# EAGLE design qo-100-rf-switch (EAGLE 9.6.2)
CNAME: None; CREVISION: 2; DESIGNER: Joao Silva
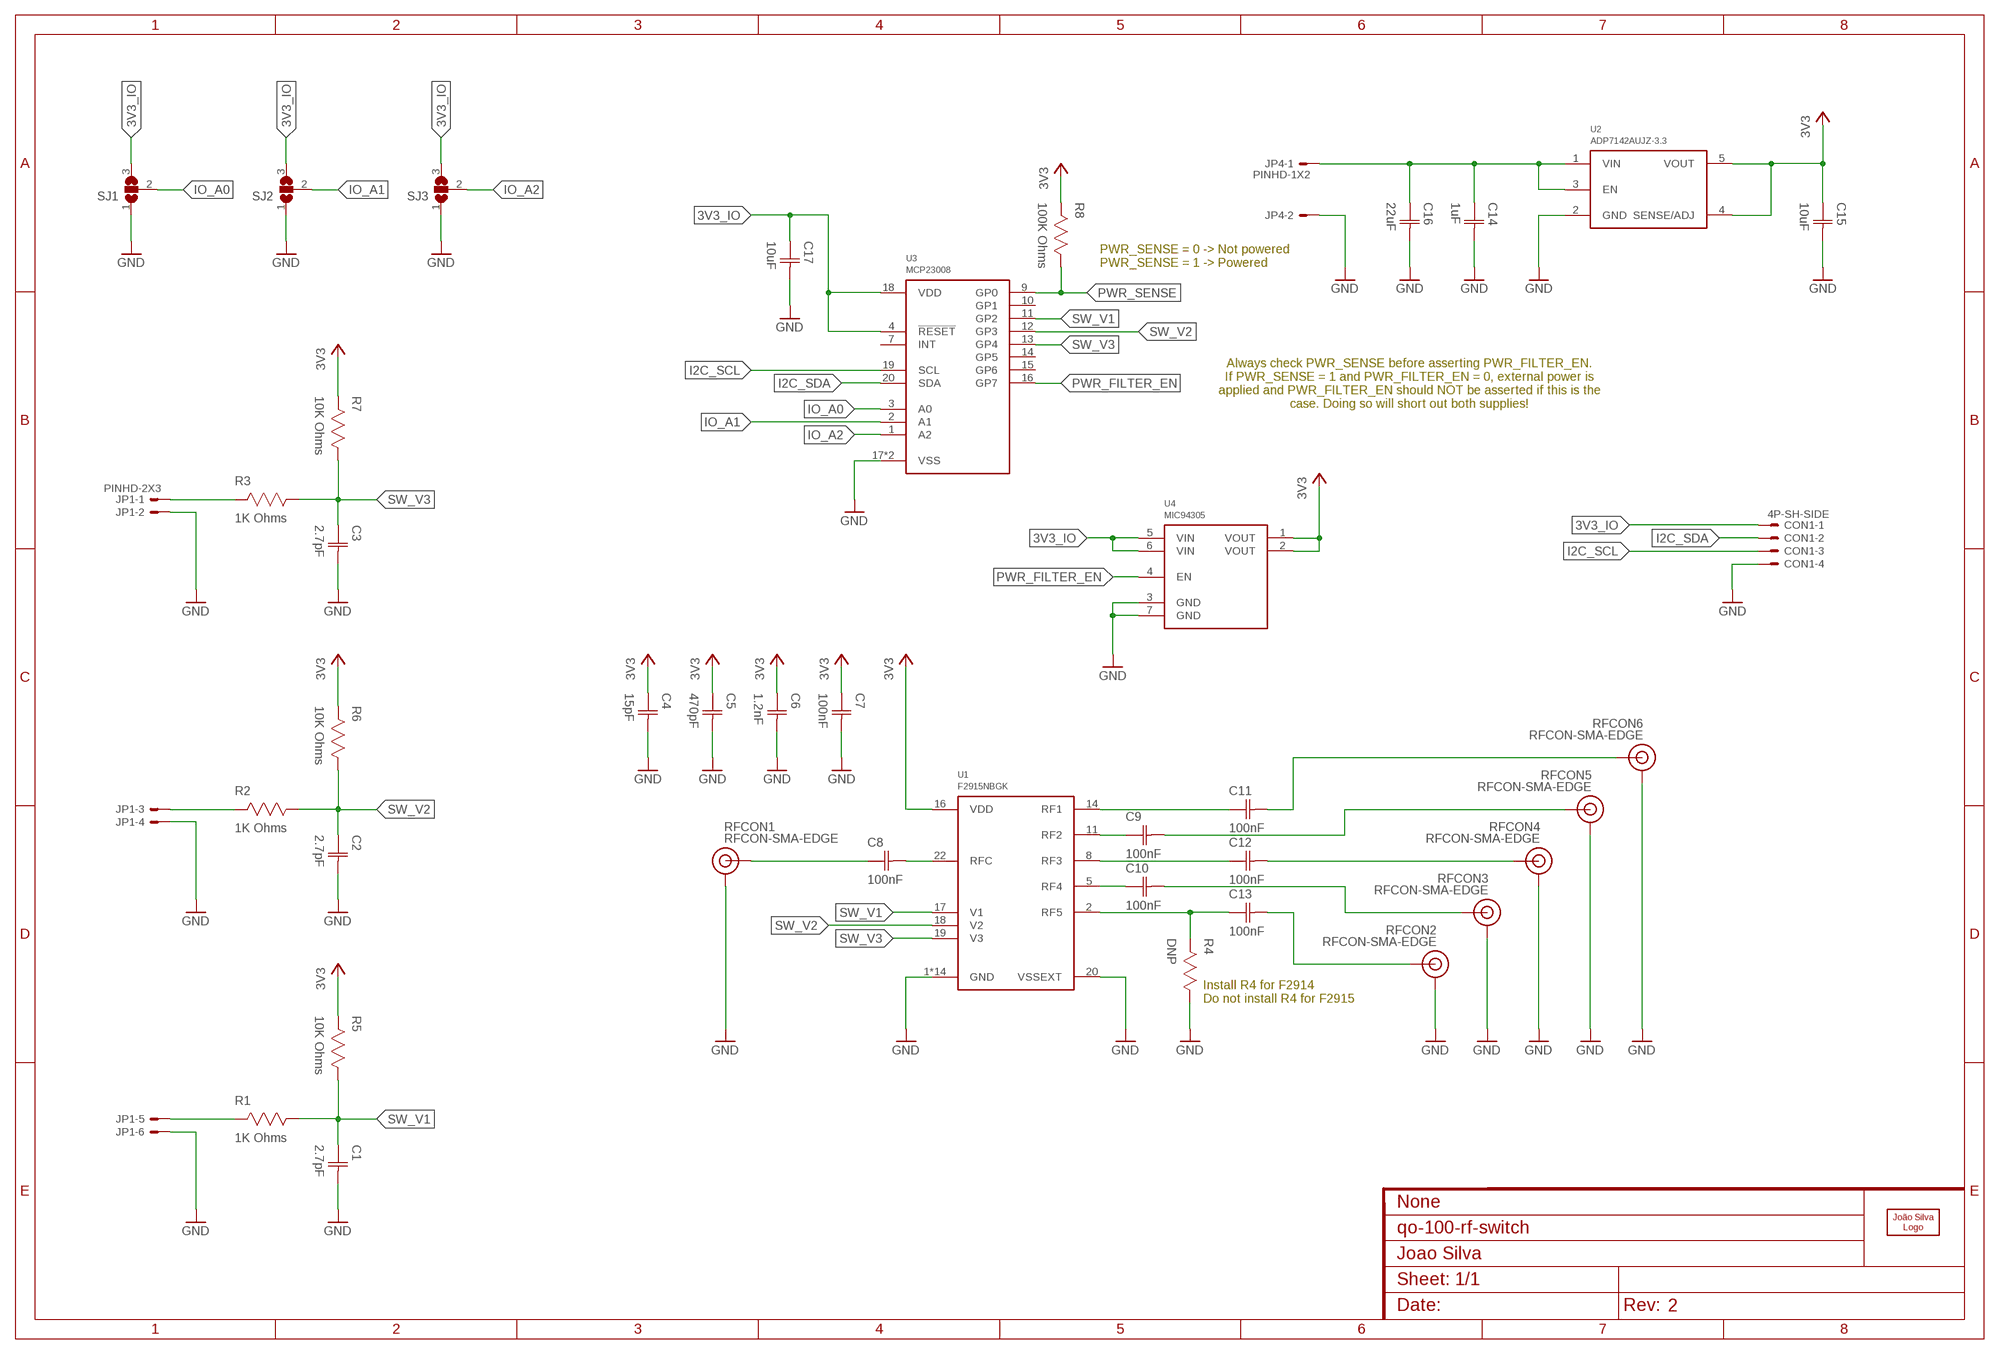
[diagram p0: schematic, sheet 1]

## Parts
C1  2.7pF  CAPACITOR-0603  [CAP0603]
C2  2.7pF  CAPACITOR-0603  [CAP0603]
C3  2.7pF  CAPACITOR-0603  [CAP0603]
C4  15pF  CAPACITOR-0603  [CAP0603]
C5  470pF  CAPACITOR-0603  [CAP0603]
C6  1.2nF  CAPACITOR-0603  [CAP0603]
C7  100nF  CAPACITOR-0603  [CAP0603]
C8  100nF  CAPACITOR-0603  [CAP0603]
C9  100nF  CAPACITOR-0603  [CAP0603]
C10  100nF  CAPACITOR-0603  [CAP0603]
C11  100nF  CAPACITOR-0603  [CAP0603]
C12  100nF  CAPACITOR-0603  [CAP0603]
C13  100nF  CAPACITOR-0603  [CAP0603]
C14  1uF  CAPACITOR-0603  [CAP0603]
C15  10uF  CAPACITOR-0603  [CAP0603]
C16  22uF  CAPACITOR-1206  [CAP1206]
C17  10uF  CAPACITOR-0603  [CAP0603]
CON1  4P-SH-SIDE  [SH-04-SIDE]
JP1  PINHD-2X3  [2X03]
JP4  PINHD-1X2  [1X02]
LOGO1  JS-5MM  [JS_5MM]
R1  1K Ohms  RESISTOR-0603  [RES0603]
R2  1K Ohms  RESISTOR-0603  [RES0603]
R3  1K Ohms  RESISTOR-0603  [RES0603]
R4  DNP  RESISTOR-0603  [RES0603]
R5  10K Ohms  RESISTOR-0603  [RES0603]
R6  10K Ohms  RESISTOR-0603  [RES0603]
R7  10K Ohms  RESISTOR-0603  [RES0603]
R8  100K Ohms  RESISTOR-0603  [RES0603]
RFCON1  RFCON-SMA-EDGE  [SMA-EDGE]
RFCON2  RFCON-SMA-EDGE  [SMA-EDGE]
RFCON3  RFCON-SMA-EDGE  [SMA-EDGE]
RFCON4  RFCON-SMA-EDGE  [SMA-EDGE]
RFCON5  RFCON-SMA-EDGE  [SMA-EDGE]
RFCON6  RFCON-SMA-EDGE  [SMA-EDGE]
SJ1  SJ2S  [SJ2_S]
SJ2  SJ2S  [SJ2_S]
SJ3  SJ2S  [SJ2_S]
U1  F2915NBGK  [QFN24]
U2  ADP7142AUJZ-3.3  [SOT23-5]
U3  MCP23008  [QFN20]
U4  MIC94305  [DFN6]

## Nets
3V3: C4.1(C1) C5.1(C1) C6.1(C1) C7.1(C1) C15.1(C1) R5.2 R6.2 R7.2 R8.2 U1.16(VDD) U2.4(SENSE/ADJ) U2.5(VOUT) U4.1(VOUT) U4.2(VOUT)
3V3_IO: C17.1(C1) CON1.1 SJ1.3 SJ2.3 SJ3.3 U3.4(!RESET) U3.18(VDD) U4.5(VIN) U4.6(VIN)
GND: C1.2(C2) C2.2(C2) C3.2(C2) C4.2(C2) C5.2(C2) C6.2(C2) C7.2(C2) C14.2(C2) C15.2(C2) C16.2(C2) C17.2(C2) CON1.4 JP1.2 JP1.4 JP1.6 JP4.2 R4.1 RFCON1.GND@0(GND) RFCON1.GND@1(GND) RFCON1.GND@2(GND) RFCON1.GND@3(GND) RFCON2.GND@0(GND) RFCON2.GND@1(GND) RFCON2.GND@2(GND) RFCON2.GND@3(GND) RFCON3.GND@0(GND) RFCON3.GND@1(GND) RFCON3.GND@2(GND) RFCON3.GND@3(GND) RFCON4.GND@0(GND) RFCON4.GND@1(GND) RFCON4.GND@2(GND) RFCON4.GND@3(GND) RFCON5.GND@0(GND) RFCON5.GND@1(GND) RFCON5.GND@2(GND) RFCON5.GND@3(GND) RFCON6.GND@0(GND) RFCON6.GND@1(GND) RFCON6.GND@2(GND) RFCON6.GND@3(GND) SJ1.1 SJ2.1 SJ3.1 U1.1(GND) U1.3(GND) U1.4(GND) U1.6(GND) U1.7(GND) U1.9(GND) U1.10(GND) U1.12(GND) U1.13(GND) U1.15(GND) U1.20(VSSEXT) U1.21(GND) U1.23(GND) U1.24(GND) U1.25(GND) U2.2(GND) U3.17(VSS) U3.PAD(VSS) U4.3(GND) U4.7(GND)
I2C_SCL: CON1.3 U3.19(SCL)
I2C_SDA: CON1.2 U3.20(SDA)
IO_A0: SJ1.2 U3.3(A0)
IO_A1: SJ2.2 U3.2(A1)
IO_A2: SJ3.2 U3.1(A2)
N$1: C8.1(C1) RFCON1.SIG(SIGNAL)
N$2: C8.2(C2) U1.22(RFC)
N$3: C13.1(C1) R4.2 U1.2(RF5)
N$4: C10.1(C1) U1.5(RF4)
N$5: C12.1(C1) U1.8(RF3)
N$6: C9.1(C1) U1.11(RF2)
N$7: C11.1(C1) U1.14(RF1)
N$8: C13.2(C2) RFCON2.SIG(SIGNAL)
N$9: C10.2(C2) RFCON3.SIG(SIGNAL)
N$10: C12.2(C2) RFCON4.SIG(SIGNAL)
N$11: C9.2(C2) RFCON5.SIG(SIGNAL)
N$12: C11.2(C2) RFCON6.SIG(SIGNAL)
N$13: JP1.1 R3.2
N$14: JP1.3 R2.2
N$15: JP1.5 R1.2
N$16: C14.1(C1) C16.1(C1) JP4.1 U2.1(VIN) U2.3(EN)
PWR_FILTER_EN: U3.16(GP7) U4.4(EN)
PWR_SENSE: R8.1 U3.9(GP0)
SW_V1: C1.1(C1) R1.1 R5.1 U1.17(V1) U3.11(GP2)
SW_V2: C2.1(C1) R2.1 R6.1 U1.18(V2) U3.12(GP3)
SW_V3: C3.1(C1) R3.1 R7.1 U1.19(V3) U3.13(GP4)
Unconnected: U3.7(INT) U3.10(GP1) U3.14(GP5) U3.15(GP6)

## Notes on the sheet
- PWR_SENSE = 0 -> Not powered
  PWR_SENSE = 1 -> Powered
- Always check PWR_SENSE before asserting PWR_FILTER_EN.
  If PWR_SENSE = 1 and PWR_FILTER_EN = 0, external power is
  applied and PWR_FILTER_EN should NOT be asserted if this is the
  case. Doing so will short out both supplies!
- Install R4 for F2914
  Do not install R4 for F2915

## Library data of the parts
C1-C17 = Capacitor:CAPACITOR
CON1 = JST:4P: Disconnectable Crimp style connector, 1.0mm pitch 4 contacts
JP1 = Pin Header:PINHD-2X3: PIN HEADER
JP4 = Pin Header:PINHD-1X2: PIN HEADER
LOGO1 = Silkscreen:JS
R1-R8 = Resistor:RESISTOR
RFCON1-RFCON6 = RF Connector:RFCON
SJ1-SJ3 = Solder Jumper:SJ2
U1 = Renesas:F2915*
U2 = Analog Devices:ADP7142AUJZ*
U3 = Microchip:MCP23008
U4 = Microchip:MIC94305

## Board
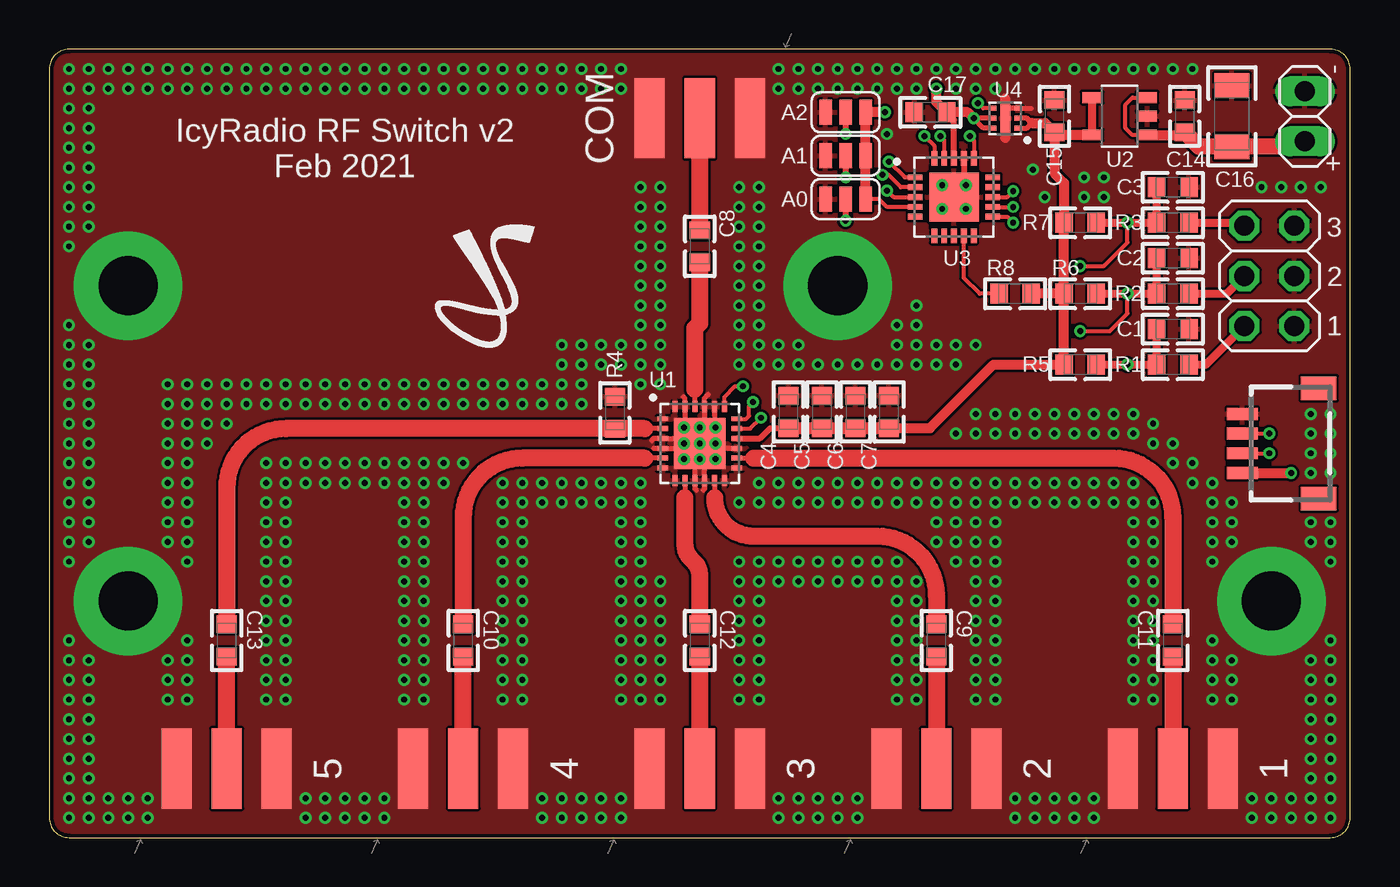
[diagram p1: board, top side]
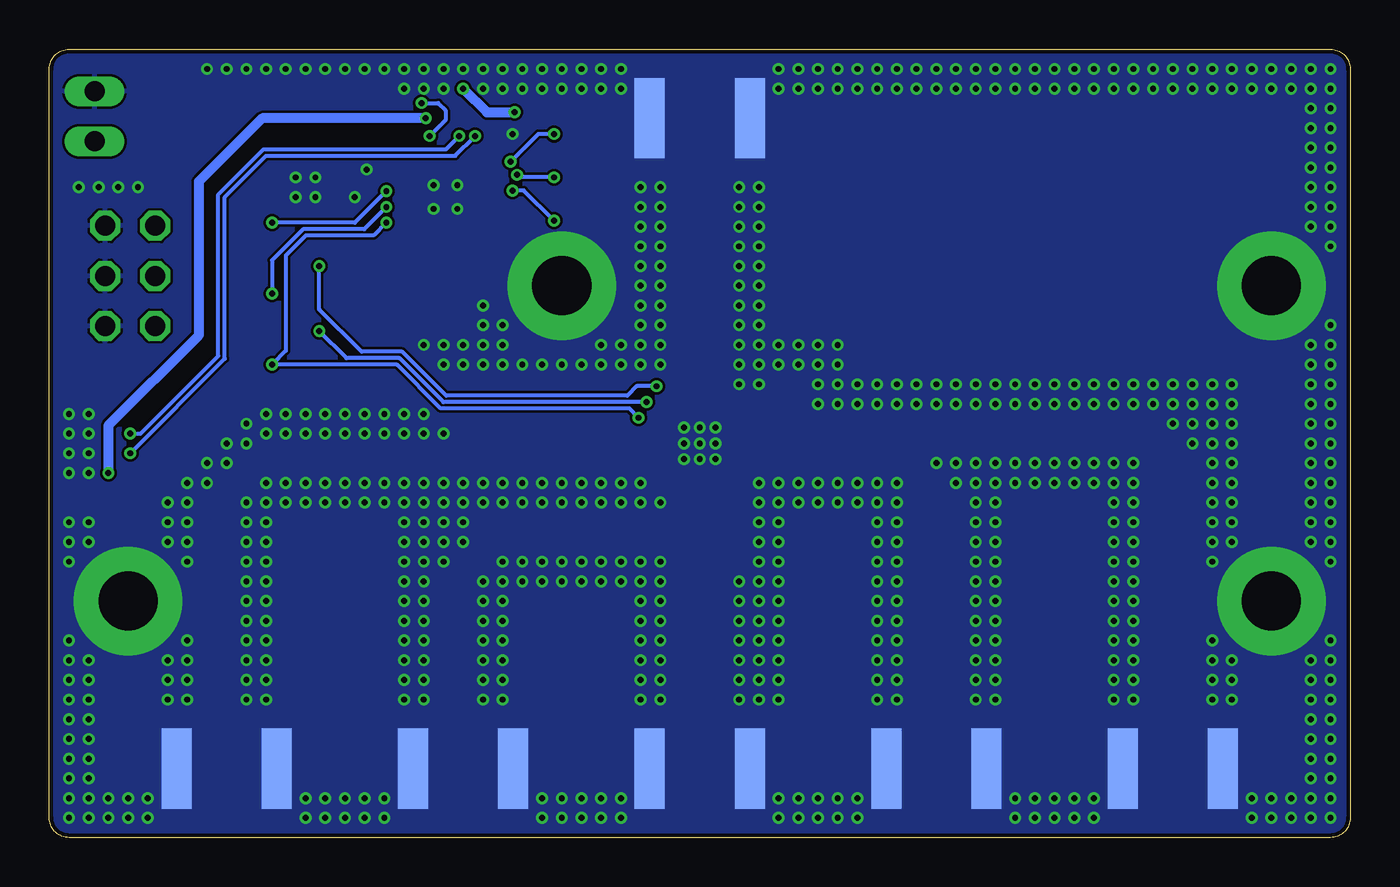
[diagram p2: board, bottom side, seen from below]

Size 66 x 40 mm. Coordinates in mm from the lower left corner, seen from the top.
Outline: 0,39 0,1 arc90 1,0 65,0 arc90 66,1 66,39 arc90 65,40 1,40 arc90 0,39
Copper layers (1*16): Top 0.035mm / dielectric 1.6mm / Bottom 0.035mm
Design rules "jlcpcb_2layer": minimum track width 5mil, minimum drill 0.3mm, track to track 5mil, track to pad 5mil, pad to pad 5mil, via to via 5mil, smd to smd 5mil, copper to edge 0.2mm, drill to drill 5mil, minimum pad ring 3mil, minimum via ring 3mil, stop-mask expansion 0.075mm, vias tented up to drill 10mm, thermal gap 5mil

### Footprints (pad centres in the part's own frame; a part is rotated, then mirrored left to right if it is on the bottom)
CAP0603 = smd 0.889 x 1.016: 1 -0.819,0; 2 0.819,0
CAP1206 = smd 1.27 x 1.778: 1 -1.549,0; 2 1.549,0
SH-04-SIDE = smd 0.6 x 1.55: 1 -1.5,2.975; 2 -0.5,2.975; 3 0.5,2.975; 4 1.5,2.975 | smd 1.2 x 1.8: FIT@1 -2.8,-0.9; FIT@2 2.8,-0.9
2X03 = drill 1.016 octagon: 1 -2.54,-1.27; 2 -2.54,1.27; 3 0,-1.27; 4 0,1.27; 5 2.54,-1.27; 6 2.54,1.27
1X02 = drill 1.016 long: 1 -1.27,0; 2 1.27,0
RES0603 = smd 0.889 x 1.016: 1 -0.819,0; 2 0.819,0
SMA-EDGE = smd 1.524 x 4.064: GND@0 -2.54,0; GND@1 2.54,0; SIG 0,0 | smd 1.524 x 4.064 bottom: GND@2 -2.54,0; GND@3 2.54,0
SJ2_S = smd 0.635 x 1.27: 1 -1.016,0; 2 0,0; 3 1.016,0
QFN24 = smd 0.55 x 0.25: 1 -1.875,1.25; 2 -1.875,0.75; 3 -1.875,0.25; 4 -1.875,-0.25; 5 -1.875,-0.75; 6 -1.875,-1.25; 13 1.875,-1.25; 14 1.875,-0.75; 15 1.875,-0.25; 16 1.875,0.25; 17 1.875,0.75; 18 1.875,1.25 | smd 0.25 x 0.55: 7 -1.25,-1.875; 8 -0.75,-1.875; 9 -0.25,-1.875; 10 0.25,-1.875; 11 0.75,-1.875; 12 1.25,-1.875; 19 1.25,1.875; 20 0.75,1.875; 21 0.25,1.875; 22 -0.25,1.875; 23 -0.75,1.875; 24 -1.25,1.875 | smd 2.6 x 2.6: 25 0,0
SOT23-5 = smd 1 x 0.55: 1 -1.4,0.95; 2 -1.4,0; 3 -1.4,-0.95; 4 1.4,-0.95; 5 1.4,0.95
QFN20 = smd 0.73 x 0.3: 1 -1.965,1; 2 -1.965,0.5; 3 -1.965,0; 4 -1.965,-0.5; 5 -1.965,-1; 11 1.965,-1; 12 1.965,-0.5; 13 1.965,0; 14 1.965,0.5; 15 1.965,1 | smd 0.3 x 0.73: 6 -1,-1.965; 7 -0.5,-1.965; 8 0,-1.965; 9 0.5,-1.965; 10 1,-1.965; 16 1,1.965; 17 0.5,1.965; 18 0,1.965; 19 -0.5,1.965; 20 -1,1.965 | smd 2.5 x 2.5: PAD 0,0
DFN6 = smd 0.25 x 0.4: 1 -0.5,-0.65; 2 0,-0.65; 3 0.5,-0.65; 4 0.5,0.65; 5 0,0.65; 6 -0.5,0.65 | smd 1.4 x 0.5: 7 0,0

### Placement (x,y rotation side)
C1  57,25.8 0 top
C2  57,29.4 0 top
C3  57,33 0 top
C4  37.5,21.6 90 top
C5  39.2,21.6 90 top
C6  40.9,21.6 90 top
C7  42.6,21.6 90 top
C8  33,30 270 top
C9  45,10 270 top
C10  21,10 270 top
C11  57,10 270 top
C12  33,10 270 top
C13  9,10 270 top
C14  57.6,36.6 90 top
C15  51,36.6 90 top
C16  60,36.6 90 top
C17  44.7,36.8 180 top
CON1  63.5,20 90 top
JP1  61.9,28.5 270 top
JP4  63.7,36.6 90 top
LOGO1  24.8,31.3 0 top
R1  57,24 0 top
R2  57,27.6 0 top
R3  57,31.2 0 top
R4  28.7,21.55 270 top
R5  52.3,24 180 top
R6  52.3,27.6 180 top
R7  52.3,31.2 180 top
R8  49,27.6 0 top
RFCON1  33,36.5 180 top
RFCON2  9,3.5 0 top
RFCON3  21,3.5 0 top
RFCON4  33,3.5 0 top
RFCON5  45,3.5 0 top
RFCON6  57,3.5 0 top
SJ1  40.4,32.4 0 top
SJ2  40.4,34.6 0 top
SJ3  40.4,36.8 0 top
U1  33,20 0 top
U2  54.3,36.6 180 top
U3  45.9,32.5 0 top
U4  48.5,36.5 90 top

### Tracks (layer width: path | path; a pad name or v marks a point on that pad's centre or on a via)
3V3
  Top 0.254: U4.1 49.6,36 49.85,36.25 49.6,36.5 U4.2
  Top 0.305: U1.16 36.05,20.25 36.58,20.78 C4.1
  Top 0.406: U2.4 U2.5
  Top 0.508: U2.5 51.13,35.65 C15.1 | C15.1 51,33.7 51.48,33.22 R7.2 R6.2 | R6.2 R5.2 47.9,24 44.68,20.78 C7.1 | 49.85,36.25 50.53,36.25 C15.1 | R6.2 R8.2
  Top 0.61: C4.1 C5.1 C6.1 C7.1
3V3_IO  (via drill 0.3)
  Top 0.2: U3.4 42.5,32 42.1,32.4 SJ1.3
  Top 0.254: U4.5 v46.9,36.5 47.4,36 U4.6
  Top 0.305: U3.18 45.9,36.42 C17.1
  Top 0.508: v42.4,36.8 SJ3.3 SJ2.3 SJ1.3 | 46.9,36.52 v46.9,36.5 46.6,36.8 C17.1 45,37.32 v45,38 | CON1.1 v63,18.5
  Bottom 0.508: v63,18.5 63,20.9 58.4,25.5 58.4,33.3 55.2,36.5 v46.9,36.5 | v45,38 43.8,36.8 v42.4,36.8
GND  (via drill 0.3, 3 pad 5.5)
  Top 0.254: 30.55,20.14 30.66,20.25 U1.3 31.95,20.25 v32.2,20 31.95,19.75 U1.4 30.66,19.75 | 33.17,17.63 33.25,17.71 U1.10 33.25,18.95 v33,19.2 32.75,18.95 U1.9 32.75,17.71 32.83,17.63 | U1.15 34.05,19.75 v33.8,20 | 32.17,22.37 32.25,22.29 U1.23 32.25,20.85 v32.2,20.8 | 33.43,22.5 33.43,22.47 33.25,22.29 U1.21 33.25,21.05 v33,20.8 | U1.20 33.75,20.85 v33.8,20.8 | 48.5,36.9 48.6,37 U4.3 49.8,37
  Top 0.305: U3.17 46.4,33 U3.PAD
  Top 0.406: U3.PAD v45.3,31.9
  Top 0.508: 48.5,37.5 48.5,36.9 U4.7 48.5,35.5
  other vias: 4,12 4,28 62,12 40,28 33,20 32.2,19.2 33.8,19.2 27,23 26,23 25,23 25,22 27,22 26,22 24,23 23,23 22,23 22,22 24,22 23,22 6,7 7,7 8,21 9,21 11,16 11,18 11,17 12,17 11,19 6,9 6,8 7,8 7,10 7,9 6,19 6,18 6,17 7,17 7,19 7,18 6,16 6,15 8,20 7,14 7,16 7,15 6,20 7,20 6,22 6,23 6,21 7,21 7,22 8,22 9,22 9,23 7,23 8,23 21,23 20,23 19,23 19,22 21,22 20,22 18,23 17,23 16,23 16,22 18,22 17,22 15,23 14,23 13,23 13,22 15,22 14,22 12,23 11,23 10,23 10,22 12,22 11,22 28,18 29,18 30,18 25,18 27,18 26,18 30,17 29,17 28,17 27,17 24,18 23,18 21,19 20,19 19,19 19,18 26,17 20,18 18,19 17,19 16,19 16,18 18,18 17,18 15,19 14,19 13,19 13,18 15,18 14,18 12,19 12,18 12,16 11,15 11,14 12,14 12,15 11,13 11,12 11,11 12,11 12,13 12,12 11,10 11,9 11,8 12,8 12,10 12,9 11,7 12,7 25,17 24,17 23,17 23,8 23,7 24,8 24,7 23,14 23,15 23,16 23,11 23,13 23,12 24,16 24,15 24,14 24,13 23,10 23,9 24,12 24,11 24,10 24,9 19,17 18,17 18,8 18,7 19,8 19,7 18,14 18,15 18,16 18,11 18,13 18,12 19,16 19,15 19,14 19,13 18,10 18,9 19,12 19,11 19,10 19,9 31,8 31,7 31,13 31,12 31,11 31,10 31,9 29,8 29,7 30,8 30,7 29,14 29,15 29,16 29,11 29,13 29,12 30,16 30,15 30,14 30,13 29,10 29,9 30,12 30,11 30,10 30,9 42,17 43,17 42,18 43,18 36,17 39,17 37,17 38,17 36,18 37,18 40,17 41,17 38,18 39,18 40,18 41,18 43,13 44,13 43,14 37,13 40,13 38,13 39,13 37,14 38,14 41,13 42,13 39,14 40,14 41,14 42,14 35,8 35,7 36,8 36,7 35,14 35,11 35,13 35,12 36,14 36,13 35,10 35,9 36,12 36,11 36,10 36,9 43,8 43,7 44,8 44,7 43,11 43,12 43,10 43,9 44,12 44,11 44,10 44,9 56,15 56,16 55,15 55,16 52,17 55,17 53,17 54,17 52,18 53,18 56,17 56,14 54,18 55,18 55,14 50,17 51,17 50,18 51,18 44,17 47,17 45,17 46,17 44,18 45,18 48,17 49,17 46,18 47,18 48,18 49,18 45,16 46,16 47,16 48,16 48,15 48,13 48,14 47,13 47,14 48,7 48,10 48,8 48,9 47,7 47,8 48,11 48,12 47,9 47,10 47,11 47,12 46,14 46,15 45,15 47,15 56,13 55,13 56,7 56,10 56,8 56,9 55,7 55,8 56,11 56,12 55,9 55,10 55,11 55,12 31,23 30,23 31,24 31,25 31,26 30,24 30,25 30,26 31,33 30,33 31,27 31,30 31,28 31,29 30,27 30,28 31,31 31,32 30,29 30,30 30,31 30,32 36,33 35,33 36,27 36,30 36,28 36,29 35,27 35,28 36,31 36,32 35,29 35,30 35,31 35,32 36,24 36,25 36,26 35,24 35,25 35,26 29,25 28,25 27,25 26,25 27,24 26,24 29,24 28,24 38,25 37,25 38,24 37,24 40,24 39,24 42,24 41,24 44,24 43,24 44,25 43,25 60,17 59,17 60,15 60,16 59,16 59,14 59,15 60,7 59,7 59,18 60,8 60,9 59,10 59,8 59,9 58,18 58,19 57,19 57,20 56,20 52,20.5 50,20.5 51,20.5 47,20.5 48,20.5 49,20.5 65,5 65,6 64,5 64,6 63,1 62,1 61,1 64,1 65,1 61,2 62,2 63,2 64,2 65,3 65,4 65,2 64,3 64,4 65,15 65,16 64,15 64,16 65,9 65,8 65,7 65,10 64,7 64,8 64,9 65,14 65,20.5 65,19.5 65,18.5 65,21.5 64,18.5 64,19.5 64,20.5 64,21.5 53,1 52,1 51,1 51,2 52,2 53,2 49,1 50,1 49,2 50,2 41,1 41,2 39,1 40,1 39,2 40,2 37,1 38,1 37,2 38,2 29,1 29,2 26,1 25,1 27,1 28,1 25,2 26,2 27,2 28,2 13,1 16,1 14,1 15,1 13,2 14,2 17,1 15,2 16,2 17,2 3,1 2,1 1,1 4,1 5,1 1,2 2,2 3,2 4,2 5,2 64.5,33 63.5,33 54,20.5 53,20.5 51,39 52,39 53,39 54,39 55,39 56,39 57,39 58,39 28,39 27,39 26,39 26,38 28,38 27,38 25,39 24,39 23,39 23,38 25,38 24,38 7,38 7,39 8,38 9,38 10,38 10,39 8,39 9,39 22,39 21,39 20,39 20,38 22,38 21,38 19,39 18,39 17,39 17,38 19,38 18,38 16,39 15,39 14,39 14,38 16,38 15,38 13,39 12,39 11,39 11,38 13,38 12,38 6,39 5,39 4,39 4,38 6,38 5,38 3,39 2,39 1,39 1,38 3,38 2,38 2,22 1,22 2,23 2,24 2,25 1,25 1,23 1,24 1,37 1,36 1,35 2,35 2,37 2,36 1,34 1,33 1,32 2,32 2,34 2,33 1,31 1,30 2,31 1,26 1,21 1,20 1,19 2,19 2,21 2,20 1,18 1,17 1,16 2,16 2,18 2,17 2,3 1,3 1,15 1,14 2,15 1,10 1,9 1,8 1,7 2,7 2,9 2,8 1,6 1,5 1,4 2,4 2,6 2,5 50,39 49,39 48,39 48,38 47,39 46,39 45,39 47,38 46,38 29,38 29,39 44,39 43,39 42,39 42,38 44,38 43,38 41,39 40,39 39,39 39,38 41,38 40,38 38,39 37,39 38,38 37,38 35,17 47,25 46,24 45,24 46,25 45,25 43,26 44,27 44,26 62.5,33 61.5,33 49.9,33.9 50.5,32.5 53.5,32.5 53.5,33.5 52.5,32.5 52.5,33.5 55,20.5 52,21.5 50,21.5 51,21.5 47,21.5 48,21.5 49,21.5 54,21.5 53,21.5 55,21.5 56,21 46,20.5 45.3,33.1 46.5,33.1 46.5,31.9 42.5,35.7
  pour Top (rank 6): -2,-2 68,-2 68,42 -2,42
  pour Bottom (rank 6): -4,-4 70,-4 70,44 -4,44
  pour Bottom (no thermals): 5,1 13,1 13,6 5,6
  pour Bottom (no thermals): 17,1 25,1 25,6 17,6
  pour Bottom (no thermals): 29,1 37,1 37,6 29,6
  pour Bottom (no thermals): 41,1 49,1 49,6 41,6
  pour Bottom (no thermals): 53,1 61,1 61,6 53,6
  pour Bottom (no thermals): 29,34 37,34 37,39 29,39
  pour Top (no thermals): 29,34 37,34 37,39 29,39
  pour Top (no thermals): 53,1 61,1 61,6 53,6
  pour Top (no thermals): 41,1 49,1 49,6 41,6
  pour Top (no thermals): 29,1 37,1 37,6 29,6
  pour Top (no thermals): 17,1 25,1 25,6 17,6
  pour Top (no thermals): 5,1 13,1 13,6 5,6
I2C_SCL  (via drill 0.3)
  Top 0.2: CON1.3 v61.9,20.5 | U3.19 45.4,35.4 v45.2,35.6
  Bottom 0.2: v61.9,20.5 61.36,20.5 57.43,24.43 57.43,32.63 55.13,34.93 45.87,34.93 v45.2,35.6
I2C_SDA  (via drill 0.3)
  Top 0.2: CON1.2 v61.9,19.5 | v44.4,35.6 44.9,35.1 U3.20
  Bottom 0.2: v61.9,19.5 57.1,24.3 57.1,32.5 55,34.6 45.4,34.6 v44.4,35.6
IO_A0  (via drill 0.3)
  Top 0.2: v42.5,32.83 42.83,32.5 U3.3
  Top 0.305: SJ1.2 v40.4,31.3
  Bottom 0.2: v40.4,31.3 41.93,32.83 v42.5,32.83
IO_A1  (via drill 0.3)
  Top 0.2: U3.2 43.2,33 42.57,33.63 v42.27,33.63
  Top 0.305: SJ2.2 v40.4,33.5
  Bottom 0.2: v40.4,33.5 42.15,33.5 v42.27,33.63
IO_A2  (via drill 0.3)
  Top 0.2: v42.6,34.3 43.4,33.5 U3.1
  Top 0.305: SJ3.2 v40.4,35.7
  Bottom 0.2: v40.4,35.7 41.2,35.7 v42.6,34.3
N$1
  Top 0.85: C8.1 RFCON1.SIG
N$2
  Top 0.254: U1.22 32.75,22.75
  Top 0.85: 32.75,22.75 32.75,25.85 33,26.1 C8.2
N$3
  Top 0.254: U1.2 30.2,20.75
  Top 0.85: R4.2 12,20.75 arc90 9,17.75 C13.1 | 30.2,20.75 R4.2 | R4.2
N$4
  Top 0.254: U1.5 30.2,19.25
  Top 0.85: 30.2,19.25 24,19.25 arc90 21,16.25 C10.1
N$5
  Top 0.254: U1.8 32.25,17.25
  Top 0.85: 32.25,17.25 32.25,14.86 arc45 32.54,14.16 32.71,13.99 arc-45 33,13.29 C12.1
N$6
  Top 0.254: U1.11 33.75,17.25
  Top 0.85: 33.75,17.25 arc90 35.7,15.3 42,15.3 arc-90 45,12.3 C9.1
N$7
  Top 0.254: U1.14 35.75,19.25
  Top 0.85: 35.75,19.25 54,19.25 arc-90 57,16.25 C11.1
N$8
  Top 0.85: RFCON2.SIG C13.2
N$9
  Top 0.85: RFCON3.SIG C10.2
N$10
  Top 0.85: RFCON4.SIG C12.2
N$11
  Top 0.85: C9.2 RFCON5.SIG
N$12
  Top 0.85: C11.2 RFCON6.SIG
N$13
  Top 0.406: R3.2 60.47,31.2 JP1.1
N$14
  Top 0.406: R2.2 59.73,27.6 JP1.3
N$15
  Top 0.406: R1.2 58.67,24 JP1.5
N$16
  Top 0.2: U2.1 54.95,35.65 54.6,36 54.6,37.2 54.95,37.55 U2.3
  Top 0.508: U2.1 57.47,35.65 C14.1
  Top 0.813: C14.1 58.33,35.05 C16.1 63.42,35.05 JP4.1
PWR_FILTER_EN  (via drill 0.3)
  Top 0.2: U4.4 47.38,37 v47.11,37.27 | v46.7,35.6 46.9,35.4 U3.16
  Bottom 0.2: v47.11,37.27 46.27,37.27 45.9,36.9 45.9,36.4 v46.7,35.6
PWR_SENSE
  Top 0.2: R8.1 47.2,27.6 46.4,28.4 U3.9
SW_V1  (via drill 0.3)
  Top 0.2: U1.17 35.55,20.75 v36.1,21.3 | U3.11 48.6,31.5 v48.9,31.2
  Top 0.406: C1.1 R1.1 v54.7,24 R5.1
  Bottom 0.2: v36.1,21.3 36.57,21.77 46.13,21.77 48.36,24 v54.7,24 54,24.7 54,29.54 52.99,30.55 49.55,30.55 v48.9,31.2
SW_V2  (via drill 0.3)
  Top 0.2: U1.18 35.35,21.25 35.5,21.4 35.5,21.9 v35.7,22.1 | v52.3,25.7 53.8,25.7 54.7,26.6 v54.7,27.6 | U3.12 v48.9,32
  Top 0.406: C2.1 R2.1 v54.7,27.6 R6.1
  Bottom 0.2: v35.7,22.1 46,22.1 48.23,24.33 50.93,24.33 v52.3,25.7 | v48.9,32 50.03,30.87 53.13,30.87 54.7,29.3 v54.7,27.6
SW_V3  (via drill 0.3)
  Top 0.2: U1.19 34.25,22.35 34.8,22.9 v35.2,22.9 | v52.3,29 53.5,29 54.7,30.2 v54.7,31.2 | U3.13 48.6,32.5 v48.9,32.8
  Top 0.406: C3.1 R3.1 v54.7,31.2 R7.1
  Bottom 0.2: v35.2,22.9 36.2,22.9 36.67,22.43 45.87,22.43 48.09,24.65 50.15,24.65 52.3,26.8 v52.3,29 | v48.9,32.8 50.5,31.2 v54.7,31.2

### Text on the board
tPlace: - | A2 | COM | IcyRadio RF Switch v2 / Feb 2021 | A1 | + | A0 | 3 | 2 | 1 | 5 | 4 | 3 | 2 | 1